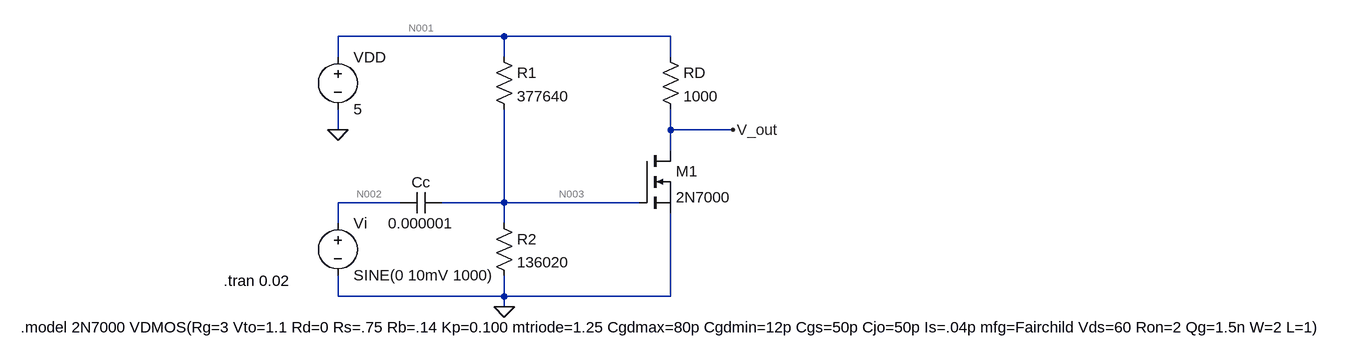
[diagram p0: schematic Draft2.asc]
Draft2.asc, the LTspice schematic file:
Version 4
SHEET 1 936 680
WIRE 256 0 0 0
WIRE 512 0 256 0
WIRE 0 32 0 0
WIRE 256 32 256 0
WIRE 512 32 512 0
WIRE 0 144 0 112
WIRE 512 144 512 112
WIRE 608 144 512 144
WIRE 512 176 512 144
WIRE 96 256 0 256
WIRE 256 256 256 112
WIRE 256 256 160 256
WIRE 464 256 256 256
WIRE 0 288 0 256
WIRE 256 288 256 256
WIRE 0 400 0 368
WIRE 256 400 256 368
WIRE 256 400 0 400
WIRE 512 400 512 272
WIRE 512 400 256 400
WIRE 256 416 256 400
FLAG 0 144 0
FLAG 608 144 V_out
FLAG 256 416 0
SYMBOL voltage 0 16 R0
WINDOW 123 0 0 Left 0
WINDOW 39 0 0 Left 0
SYMATTR InstName VDD
SYMATTR Value 5
SYMBOL cap 160 240 R90
WINDOW 0 0 32 VBottom 2
WINDOW 3 32 32 VTop 2
SYMATTR InstName Cc
SYMATTR Value 0.000001
SYMBOL res 240 16 R0
SYMATTR InstName R1
SYMATTR Value 377640
SYMBOL res 496 16 R0
SYMATTR InstName RD
SYMATTR Value 1000
SYMBOL res 240 272 R0
SYMATTR InstName R2
SYMATTR Value 136020
SYMBOL nmos 464 176 R0
SYMATTR InstName M1
SYMATTR Value 2N7000
SYMBOL voltage 0 272 R0
WINDOW 123 0 0 Left 0
WINDOW 39 0 0 Left 0
SYMATTR InstName Vi
SYMATTR Value SINE(0 10mV 1000)
TEXT -488 448 Left 2 !.model 2N7000 VDMOS(Rg=3 Vto=1.1 Rd=0 Rs=.75 Rb=.14 Kp=0.100 mtriode=1.25 Cgdmax=80p Cgdmin=12p Cgs=50p Cjo=50p Is=.04p mfg=Fairchild Vds=60 Ron=2 Qg=1.5n W=2 L=1)
TEXT -176 376 Left 2 !.tran 0.02

The netlist it stands for:
* Draft2.asc
VDD N001 0 5
Cc N003 N002 0.000001
R1 N001 N003 377640
RD N001 V_out 1000
R2 N003 0 136020
M1 V_out N003 0 0 2N7000
Vi N002 0 SINE(0 10mV 1000)
.model NMOS NMOS
.model PMOS PMOS
.lib standard.mos
.model 2N7000 VDMOS(Rg=3 Vto=1.1 Rd=0 Rs=.75 Rb=.14 Kp=0.100 mtriode=1.25 Cgdmax=80p Cgdmin=12p Cgs=50p Cjo=50p Is=.04p mfg=Fairchild Vds=60 Ron=2 Qg=1.5n W=2 L=1)
.tran 0.02
.backanno
.end

* Results of the author's LTspice run, read from the files saved beside the schematic
* Operating Point, zero values left out:
*   V(n001) = 5 V
*   V(n003) = 1.324 V
*   V(n002) = 1.324 µV
*   V(v_out) = 167.3 mV
*   Id(M1) = 4.833 mA
*   Is(M1) = -4.833 mA
*   I(R2) = 9.734 µA
*   I(Rd) = 4.833 mA
*   I(R1) = 9.734 µA
*   I(Vdd) = -4.842 mA